# EAGLE design dengenver4.1 (EAGLE 9.6.2)
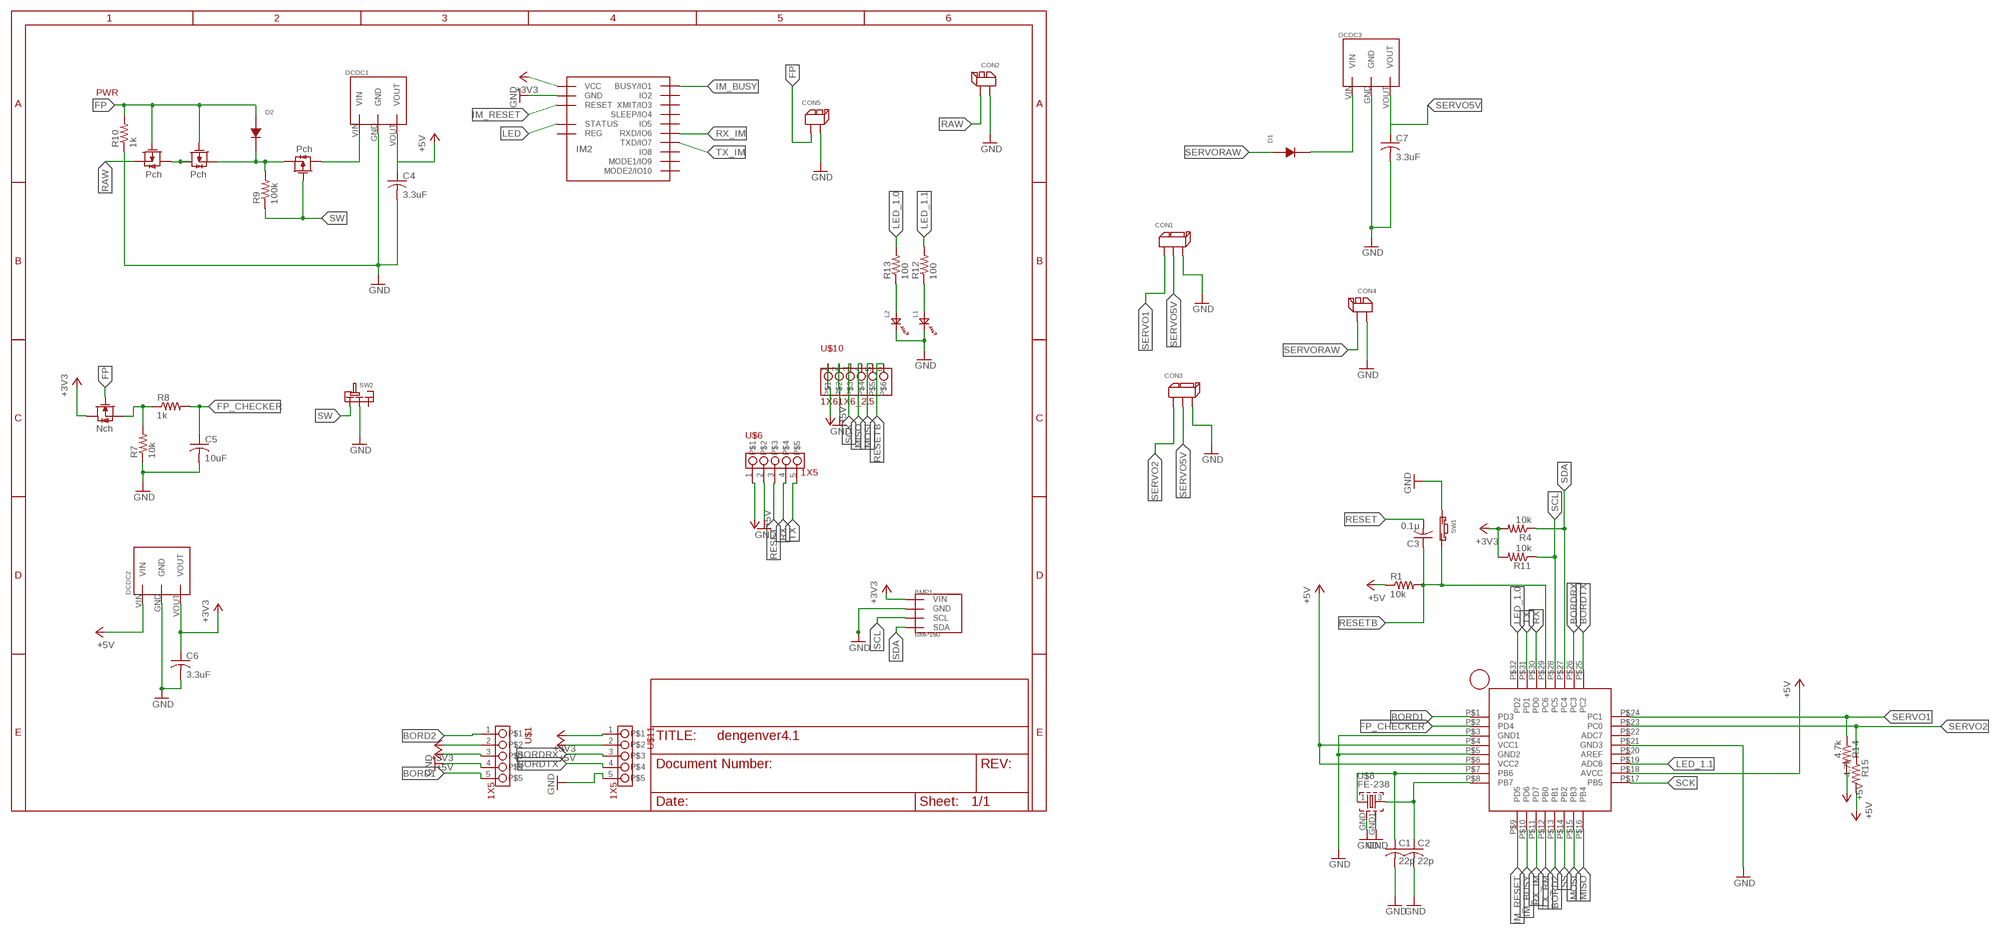
[diagram p0: schematic, sheet 1]

## Parts
BMP1  BMP180  [GY-68]
C1  22p  C-USC1608  [C1608]
C2  22p  C-USC1608  [C1608]
C3  0.1μ  C-USC1608  [C1608]
C4  3.3uF  C-USC1608  [C1608]
C5  10uF  C-USC1608  [C1608]
C6  3.3uF  C-USC1608  [C1608]
C7  3.3uF  C-USC0603  [C0603]
CON1  3PIN  [3PIN]
CON2  2PIN  [2PIN]
CON3  3PIN  [3PIN]
CON4  2PIN  [2PIN]
CON5  2PIN  [2PIN]
D1  1W4148W  [SOD-123]
D2  1W4148W  [SOD-123]
DCDC1  5V1A_M78AR05-1  [5V1A_M78AR05-1]
DCDC2  3.3V1A_M78AR033-1  [3.3V1A_M78AR033-1]
DCDC3  5V1A_M78AR05-1  [5V1A_M78AR05-1]
IM2  IM920_IM920C  [IM920_IM920C]
L1  OSXX1608C1A  [OSXX1608C1A]
L2  OSXX1608C1A  [OSXX1608C1A]
R1  10k  R-US_R0603  [R0603]
R4  10k  R-US_R0603  [R0603]
R7  10k  R-US_R0603  [R0603]
R8  1k  R-US_R0603  [R0603]
R9  100k  R-US_R0603  [R0603]
R10  1k  R-US_R0603  [R0603]
R11  10k  R-US_R0603  [R0603]
R12  100  R-US_R0603  [R0603]
R13  100  R-US_R0603  [R0603]
R14  4.7k  R-US_R0603  [R0603]
R15  4.7k  R-US_R0603  [R0603]
SW1  TVAF06-A020B-R  [TVAF06-A020B-R]
SW2  SRIDE_SWITCH  [SRIDE_SWITCH]
U$1  1X5  [HDRVR5W64P254_1X5_1310X250X865B]
U$2  2SJ681-PCH  [2SJ681]
U$3  2SK4017-NCH  [2SK4017]
U$4  2SJ681-PCH  [2SJ681]
U$5  2SJ681-PCH  [2SJ681]
U$6  1X5  [HDRVR5W64P254_1X5_1310X250X865B]
U$7  ATMEGA328P-AUATMEGA328P-AU  [ATMEGA328P-AU]
U$8  FE-238  [OSCCC300X230X120N]
U$10  1X61X6_2.5  [HDRVR6W64P254_1X6_1564X250X865B]
U$11  1X5  [HDRVR5W64P254_1X5_1310X250X865B]

## Nets
+3V3: BMP1.P1(VIN) C6.1 DCDC2.VOUT IM2.$P17(VCC) R4.2 R11.2 U$1.2 U$3.DRAIN U$11.1
+5V: C4.1 DCDC1.VOUT DCDC2.VIN R1.1 R14.2 R15.2 U$1.3 U$6.1 U$7.P$4(VCC1) U$7.P$6(VCC2) U$7.P$18(AVCC) U$10.1 U$11.2
+5V1: DCDC1.VIN U$5.DRAIN
BORD1: U$1.5 U$7.P$1(PD3)
BORD2: U$1.1 U$7.P$13(PB1)
BORDRX: U$7.P$26(PC3) U$11.3
BORDTX: U$7.P$25(PC2) U$11.4
FP: CON5.P$1 D2.C R10.2 U$2.GATE U$3.GATE U$4.GATE
FP1: D1.C
FP_CHECKER: C5.1 R8.2 U$7.P$2(PD4)
GND: BMP1.P2(GND) C1.2 C2.2 C4.2 C5.2 C6.2 C7.2 CON1.P$3 CON2.P$1 CON3.P$3 CON4.P$1 CON5.P$2 DCDC1.GND DCDC2.GND DCDC3.GND IM2.$P18(GND) L1.CT L2.CT R7.1 R10.1 SW1.P$1 SW2.LR U$1.4 U$6.2 U$7.P$3(GND1) U$7.P$5(GND2) U$7.P$21(GND3) U$8.GND U$8.GND1 U$10.2 U$11.5
IM_BUSY: IM2.$P1(BUSY/IO1) U$7.P$10(PD6)
IM_RESET: IM2.$P19(RESET) U$7.P$9(PD5)
LED: IM2.$P15(STATUS)
LED_1.0: R13.2 U$7.P$32(PD2)
LED_1.1: R12.2 U$7.P$19(ADC6)
MISO: U$7.P$16(PB4) U$10.4
MOSI: U$7.P$15(PB3) U$10.5
N$2: U$2.DRAIN U$4.DRAIN
N$3: D2.A R9.2 U$4.SOURCE U$5.SOURCE
N$9: L2.AN R13.1
N$10: L1.AN R12.1
N$12: C1.1 U$7.P$7(PB6) U$8.1
N$13: C2.1 U$7.P$8(PB7) U$8.3
N$14: R7.2 R8.1 U$3.SOURCE
RAW: CON2.P$2 U$2.SOURCE
RESET: C3.2 U$6.3
RESETB: C3.1 R1.2 SW1.P$2 U$7.P$29(PC6) U$10.6
RX: U$6.4 U$7.P$30(PD0)
RX_IM: IM2.$P6(RXD/IO6) U$7.P$11(PD7)
SCK: U$7.P$17(PB5) U$10.3
SCL: BMP1.P3(SCL) R11.1 U$7.P$28(PC5)
SDA: BMP1.P4(SDA) R4.1 U$7.P$27(PC4)
SERVO1: CON1.P$1 R14.1 U$7.P$24(PC1)
SERVO2: CON3.P$1 R15.1 U$7.P$23(PC0)
SERVO5V: C7.1 CON1.P$2 CON3.P$2 DCDC3.VOUT
SERVORAW: CON4.P$2 D1.A DCDC3.VIN
SS: U$7.P$14(PB2)
SW: R9.1 SW2.L U$5.GATE
TX: U$6.5 U$7.P$31(PD1)
TX_IM: IM2.$P7(TXD/IO7)
TX_RM: U$7.P$12(PB0)
Unconnected: IM2.$P2(IO2) IM2.$P3(XMIT/IO3) IM2.$P4(SLEEP/IO4) IM2.$P5(IO5) IM2.$P8(IO8) IM2.$P9(MODE1/IO9) IM2.$P10(MODE2/IO10) IM2.$P16(REG) SW2.R U$7.P$20(AREF) U$7.P$22(ADC7)

## Notes on the sheet
- PWR

## Library data of the parts
BMP1 = BMP180:BMP180
C1-C7 = rcl:C-US: CAPACITOR, American symbol; SPICEPREFIX: C
CON1 CON3 = XR Connector:3PIN
CON2 CON4 CON5 = XR Connector:2PIN
D1 D2 = ChipDiodes:1W4148W
DCDC1 DCDC3 = DC-DC:5V1A_M78AR05-1
DCDC2 = DC-DC:3.3V1A_M78AR033-1
IM2 = CANSAT12th:IM920_IM920C
L1 L2 = Chip LED:OSXX1608C1A
R1 R4 R7-R15 = rcl:R-US_: RESISTOR, American symbol; SPICEPREFIX: R
SW1 = Tact switch:TVAF06-A020B-R
SW2 = Sride Switch:SRIDE_SWITCH
U$1 U$6 U$11 = pin_socket:1X5
U$2 U$4 U$5 = mosfet:2SJ681-PCH
U$3 = mosfet:2SK4017-NCH
U$7 = ATMEGA328P-AU:ATMEGA328P-AU
U$8 = FA-238:FE-238
U$10 = pin_socket:1X6

## Board
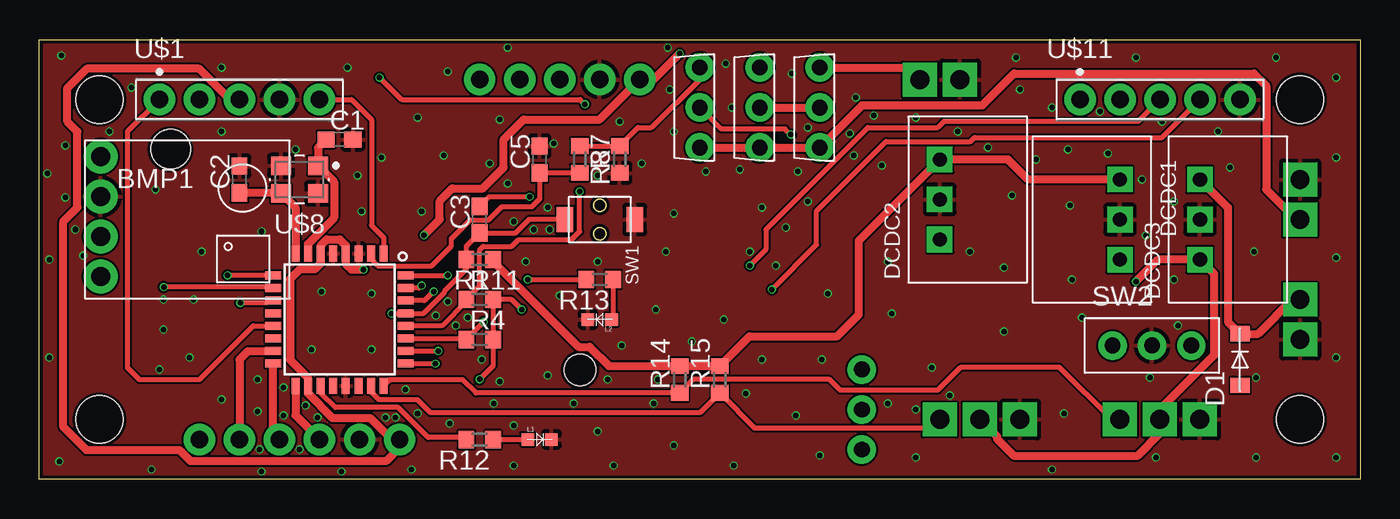
[diagram p1: board, top side]
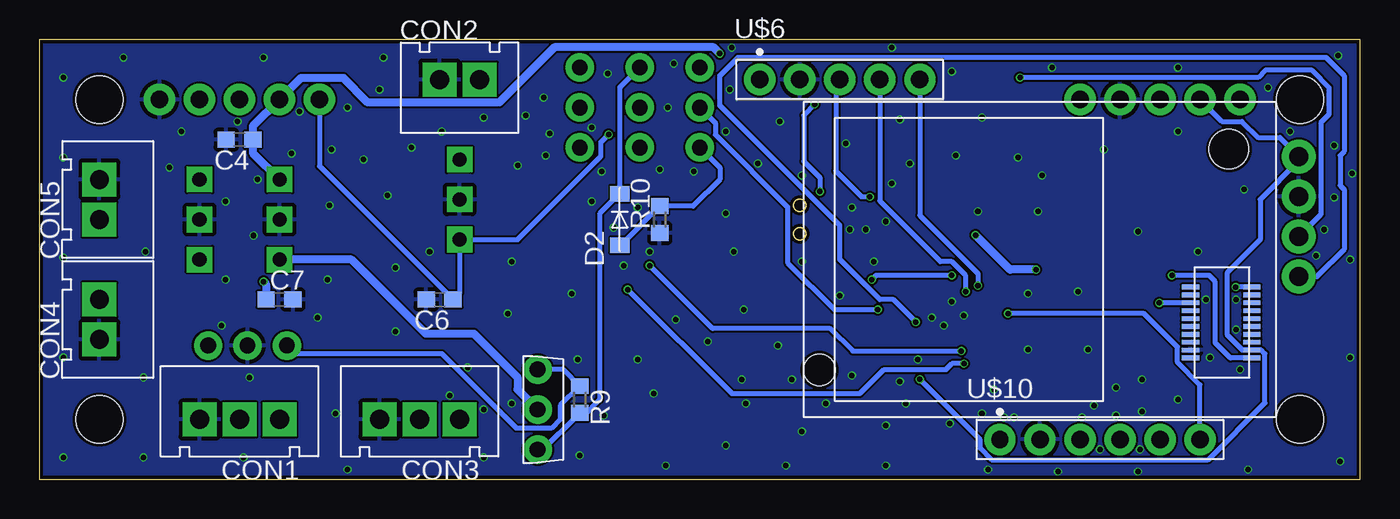
[diagram p2: board, bottom side, seen from below]

Size 83.82 x 27.94 mm. Coordinates in mm from the lower left corner, seen from the top.
Outline: 0,0 0,27.94 83.82,27.94 83.82,0 0,0
Copper layers (1*16): Top 0.035mm / dielectric 1.6mm / Bottom 0.035mm
Design rules "jlcpcb-2layers": minimum track width 5mil, minimum drill 0.3mm, track to track 5mil, track to pad 5mil, pad to pad 5mil, via to via 5mil, smd to smd 5mil, copper to edge 0.2mm, drill to drill 6mil, minimum pad ring 10mil, minimum via ring 3mil, stop-mask expansion 4mil, vias tented up to drill 0mil, thermal gap 10mil
Holes 3 mm at 3.81,24.13 3.81,3.81 80.01,3.81 80.01,24.13

### Footprints (pad centres in the part's own frame; a part is rotated, then mirrored left to right if it is on the bottom)
GY-68 = drill 1.2: P1 -5,4; P2 -5,1.46; P3 -5,-1.08; P4 -5,-3.62
C1608 = smd 1.1 x 1: 1 -0.85,0; 2 0.85,0
C0603 = smd 1.1 x 1: 1 -0.85,0; 2 0.85,0
3PIN = drill 1.2 square: P$1 2.54,-2.54; P$2 5.08,-2.54; P$3 7.62,-2.54
2PIN = drill 1.2 square: P$1 -1.27,0; P$2 1.27,0
SOD-123 = smd 0.97 x 1.22: A 1.64,0; C -1.64,0
5V1A_M78AR05-1 = drill 0.9 pad 1.27 square: GND 0,0; VIN 2.54,0; VOUT -2.54,0
3.3V1A_M78AR033-1 = drill 0.9 pad 1.27 square: GND 0,0; VIN 2.54,0; VOUT -2.54,0
IM920_IM920C = smd 0.3 x 1.1: $P1 -1.75,-13.45; $P2 -1.75,-9.55; $P3 -2.25,-13.45; $P4 -2.25,-9.55; $P5 -2.75,-13.45; $P6 -2.75,-9.55; $P7 -3.25,-13.45; $P8 -3.25,-9.55; $P9 -3.75,-13.45; $P10 -3.75,-9.55; $P11 -4.25,-13.45; $P12 -4.25,-9.55; $P13 -4.75,-13.45; $P14 -4.75,-9.55; $P15 -5.25,-13.45; $P16 -5.25,-9.55; $P17 -5.75,-13.45; $P18 -5.75,-9.55; $P19 -6.25,-13.45; $P20 -6.25,-9.55 | hole 2.5: 7,-12 | hole 2: -7,14
OSXX1608C1A = smd 0.8 x 0.8: AN -0.75,0; CT 0.75,0
R0603 = smd 1 x 1.1: 1 -0.85,0; 2 0.85,0
TVAF06-A020B-R = smd 1.6 x 1.05: P$1 0,2.225; P$2 0,-2.225
SRIDE_SWITCH = drill 1: L -2.5,0; LR 0,0; R 2.5,0
HDRVR5W64P254_1X5_1310X250X865B = drill 1.105 pad 1.705: 1 0,0; 2 2.54,0; 3 5.08,0; 4 7.62,0; 5 10.16,0
2SJ681 = drill 1: DRAIN 0,0; GATE 2.54,0; SOURCE -2.54,0
2SK4017 = drill 1: DRAIN 0,0; GATE 2.54,0; SOURCE -2.54,0
ATMEGA328P-AU = smd 1.016 x 0.508: P$1 -4.2,2.8; P$2 -4.2,2; P$3 -4.2,1.2; P$4 -4.2,0.4; P$5 -4.2,-0.4; P$6 -4.2,-1.2; P$7 -4.2,-2; P$8 -4.2,-2.8; P$17 4.2,-2.8; P$18 4.2,-2; P$19 4.2,-1.2; P$20 4.2,-0.4; P$21 4.2,0.4; P$22 4.2,1.2; P$23 4.2,2; P$24 4.2,2.8 | smd 0.508 x 1.016: P$9 -2.8,-4.2; P$10 -2,-4.2; P$11 -1.2,-4.2; P$12 -0.4,-4.2; P$13 0.4,-4.2; P$14 1.2,-4.2; P$15 2,-4.2; P$16 2.8,-4.2; P$25 2.8,4.2; P$26 2,4.2; P$27 1.2,4.2; P$28 0.4,4.2; P$29 -0.4,4.2; P$30 -1.2,4.2; P$31 -2,4.2; P$32 -2.8,4.2
OSCCC300X230X120N = smd 1.262 x 1.162: 1 -1.175,-0.875; 3 1.175,0.875; GND 1.175,-0.875; GND1 -1.175,0.875
HDRVR6W64P254_1X6_1564X250X865B = drill 1.105 pad 1.705: 1 0,0; 2 2.54,0; 3 5.08,0; 4 7.62,0; 5 10.16,0; 6 12.7,0

### Placement (x,y rotation side)
BMP1  8.89,16.51 0 top
C1  19.05,21.59 0 top
C2  12.7,19.05 90 top
C3  27.94,16.51 90 top
C4  71.12,21.59 180 bottom
C5  31.75,20.32 90 top
C6  58.42,11.43 180 bottom
C7  68.58,11.43 0 bottom
CON1  66.04,1.27 180 bottom
CON2  57.15,25.4 0 bottom
CON3  54.61,1.27 180 bottom
CON4  80.01,10.16 90 bottom
CON5  80.01,17.78 90 bottom
D1  76.2,7.62 90 top
D2  46.99,16.51 90 bottom
DCDC1  68.58,16.51 270 top
DCDC2  57.15,17.78 90 top
DCDC3  73.66,16.51 90 top
IM2  20.32,13.97 90 bottom
L1  31.75,2.54 0 top
L2  35.56,10.16 180 top
R1  27.94,13.97 180 top
R4  27.94,8.89 0 top
R7  36.83,20.32 90 top
R8  34.29,20.32 270 top
R9  49.53,5.08 270 bottom
R10  44.45,16.51 90 bottom
R11  27.94,11.43 0 top
R12  27.94,2.54 180 top
R13  35.56,12.7 180 top
R14  40.64,6.35 90 top
R15  43.18,6.35 90 top
SW1  35.56,16.51 270 top
SW2  70.61,8.51 0 top
U$1  7.62,24.13 0 top
U$2  49.53,23.62 270 top
U$3  41.91,23.62 270 top
U$4  45.72,23.62 270 top
U$5  52.2,4.45 90 bottom
U$6  38.1,25.4 0 bottom
U$7  19.05,10.16 270 top
U$8  16.51,19.05 180 top
U$10  22.86,2.54 0 bottom
U$11  66.04,24.13 0 top

### Tracks (layer width: path | path; a pad name or v marks a point on that pad's centre or on a via)
+3V3  (via drill 0.35)
  Top 0.305: v27.94,6.36 28.79,7.21 R4.2 R11.2 29.97,11.43 v30.61,10.79 | v47.69,21.91 47.33,22.26 43.27,22.26 U$3.DRAIN
  Bottom 0.305: v27.94,6.36 24.13,2.56 24.13,2.01 23.39,1.27 9.63,1.27 6.04,4.86 6.04,7.99 6.28,8.22 IM2.$P17 7.48,8.22 8.43,9.17 8.43,13.16 6.35,15.24 6.35,17.78 3.89,20.24 BMP1.P1 5.09,21.71 6.47,21.71 7.49,22.73 8.76,22.73 U$1.2 | U$11.1 66.04,19.9 C6.1 57.15,11.85 DCDC2.VOUT 53.47,15.24 48.2,20.51 48.2,21.4 v47.69,21.91 | U$3.DRAIN 40.92,22.63 40.92,21.9 36.34,17.31 36.34,13.76 33.38,10.79 v30.61,10.79
+5V  (via drill 0.35)
  Top 0.508: DCDC1.VOUT 62.74,19.05 61.47,20.32 DCDC2.VIN 51.99,15.16 51.99,10.46 50.62,9.1 45.08,9.1 R15.2 R14.2 36.15,7.2 34.92,8.42 34.21,8.42 28.79,13.84 R1.1 | v24.41,15.52 25.4,16.51 25.4,17.67 26.21,18.48 28.13,18.48 29.46,19.81 29.46,21.59 30.73,22.86 35.56,22.86 U$6.1 38.99,25.4 v40.64,27.05 | U$1.3 12.11,24.13 10.15,26.08 3,26.08 1.78,24.86 1.78,22.73 2.41,22.1 2.41,17.27 1.52,16.38 1.52,3.33 3,1.86 8.9,1.86 9.59,1.16 21.99,1.16 22.86,2.03 U$10.1 22.35,2.54 20.98,3.92 18.59,3.92 17.05,5.46 U$7.P$18 17.05,6.47 15.91,7.61 15.91,12.73 16.52,13.34 17.47,13.34 17.85,13.72 U$7.P$6 17.85,14.86 18.24,15.25 19.06,15.25 19.45,14.86 U$7.P$4 19.45,13.7 19.81,13.33 v20.57,13.33
  Bottom 0.508: v20.57,13.33 22.22,13.33 v24.41,15.52 | v40.64,27.05 41.03,27.44 51.14,27.44 54.64,23.94 62.98,23.94 64.54,25.51 67.2,25.51 U$11.2 70.27,22.44 C4.1 70.27,20.74 DCDC1.VOUT
+5V1
  Bottom 0.508: DCDC1.VIN 64.01,13.97 59.31,9.27 56.26,9.27 53.48,6.49 53.48,5.73 U$5.DRAIN
BORD1
  Top 0.305: U$1.5 19.81,24.13 21.08,22.86 21.08,16.13 21.85,15.36 U$7.P$1
BORD2
  Top 0.305: U$1.1 5.59,22.1 5.59,7.11 6.35,6.35 10.16,6.35 13.57,9.76 U$7.P$13
BORDRX  (via drill 0.35)
  Top 0.305: U$11.3 69.72,22.73 57.4,22.73 57.02,22.35 52.58,22.35 46.1,15.88 46.1,14.61 v45.09,13.59 | U$7.P$26 v25.3,8.16
  Bottom 0.305: v25.3,8.16 32.2,8.16 33.63,9.59 41.09,9.59 v45.09,13.59
BORDTX  (via drill 0.35)
  Top 0.305: U$7.P$25 v25.14,7.36 | v46.48,12.06 49.33,14.91 49.33,17.05 53.74,21.46 59.1,21.46 59.35,21.72 71.25,21.72 U$11.4
  Bottom 0.305: v25.14,7.36 25.9,7.36 26.28,6.98 30.22,6.98 31.74,5.46 39.87,5.46 v46.48,12.06
FP
  Top 0.508: U$3.GATE U$4.GATE U$2.GATE 52.2,23.75 59.82,23.75 61.85,25.78 77.09,25.78 77.85,25.02 77.85,18.41 79.76,16.51 CON5.P$1
  Bottom 0.305: U$3.GATE 40.64,19.81 40.64,19.05 42.33,17.36 R10.2 46.94,14.87 D2.C
FP_CHECKER
  Top 0.305: R8.2 C5.1 31.75,17.82 31.24,17.31 29.34,17.31 28.52,16.49 27.32,16.49 26.14,15.31 26.14,14.84 24.88,13.57 21.48,13.57 21.05,14 U$7.P$2
GND  (via drill 0.35)
  other vias: 44.45,19.68 48.13,19.56 45.85,17.27 42.29,19.56 45.09,14.48 51.44,21.97 63.25,20.32 62.23,24.77 55.63,22.99 65.28,20.95 58.29,22.1 64.26,23.62 51.69,20.57 60.2,21.08 48.77,17.65 47.37,16 46.74,13.59 67.31,23.37 61.21,13.46 53.47,19.94 59.05,14.48 50.04,11.81 53.85,13.84 54.1,10.54 61.72,18.03 65.53,12.7 61.21,9.4 49.66,7.62 45.85,7.62 44.83,5.46 48.01,4.06 53.85,4.83 55.63,4.45 57.79,5.33 55.63,1.4 64.26,0.64 70.87,1.4 77.22,6.48 72.26,9.78 77.09,14.48 82.3,14.1 82.3,7.75 82.3,20.45 75.56,19.81 78.49,26.8 61.98,26.8 69.6,26.8 52.96,23.11 51.82,24.26 43.94,23.62 47.75,25.78 43.56,26.42 48.77,22.35 39.88,27.43 29.72,27.43 25.91,25.91 19.56,26.16 11.56,26.16 1.4,26.92 0.51,19.43 0.64,13.97 0.64,7.75 1.27,1.14 7.11,0.64 23.62,0.64 14.1,0.51 19.18,0.51 17.27,8.26 17.91,11.94 21.08,11.81 21.08,8.26 11.56,5.08 13.84,6.35 13.84,4.32 15.49,5.84 15.49,4.06 16.89,4.7 17.65,3.94 13.97,1.91 16.51,1.91 7.87,11.43 7.87,9.53 7.62,6.98 9.53,7.75 9.78,11.43 14.1,15.75 10.29,14.48 11.56,22.1 20.19,19.3 24,22.99 24.26,17.02 20.45,17.02 7.37,18.41 16.26,20.95 39.12,10.79 39.75,14.48 35.43,19.3 40.26,16.89 40.26,22.1 43.43,10.16 41.4,8.76 36.96,8.51 36.07,6.35 39.24,6.35 38.99,4.83 33.91,4.83 28.83,4.83 24,4.19 23.24,5.71 26.04,3.56 30.1,3.43 30.1,0.89 36.45,0.89 44.07,0.89 40.26,2.16 35.43,3.05 49.53,1.52 21.97,3.94 22.61,3.94 29.21,6.22 32.26,6.6 26.42,9.78 25.15,10.41 28.07,7.62 25.91,11.3 27.18,10.29 33.02,11.68 35.43,13.84 82.3,1.4 77.22,1.4 82.3,25.53 70.23,15.49 67.82,20.7 66.17,10.29 70.48,6.48 38.23,20.07 40.01,24.77 29.21,22.86 29.72,18.8 32.64,21.34 32.38,15.88 31.37,15.88 32.26,17.27 30.86,13.84 30.1,16.38 28.57,20.07 25.65,20.57 21.72,20.45 2.79,14.22 2.29,15.88 1.65,17.91 1.65,21.21 72.01,17.65 72.01,12.7 56.64,7.11 71.25,22.73 74.8,22.1 5.84,24.89 4.45,22.1 65.41,17.4 69.98,19.05 65.02,4.19 36.83,22.73
  pour Top: 97.79,1.27 72.39,-24.13 -46.99,-24.13 -77.47,6.35 -77.47,62.23 -46.99,92.71 45.72,92.71 72.39,92.71 91.44,73.66 97.79,67.31
  pour Bottom: -46.99,-24.13 -77.47,6.35 -77.47,63.5 -48.26,92.71 71.12,92.71 97.79,66.04 97.79,2.54 69.85,-25.4 -46.99,-25.4
IM_BUSY  (via drill 0.35)
  Top 0.305: U$7.P$10 14.56,12.16 14.5,12.22 v7.9,12.22
  Bottom 0.305: IM2.$P1 v7.9,12.22
IM_RESET  (via drill 0.35)
  Top 0.305: U$7.P$9 v11.94,12.96
  Bottom 0.305: IM2.$P19 8.23,7.72 9.19,8.68 9.19,12.57 9.58,12.96 v11.94,12.96
LED_1.0  (via drill 0.35)
  Top 0.305: U$7.P$32 v25.91,12.96 | v30.99,12.7 R13.2
  Bottom 0.305: v25.91,12.96 30.73,12.96 v30.99,12.7
LED_1.1
  Top 0.305: U$7.P$19 17.85,5.83 17.86,5.82 17.86,5.5 18.79,4.57 22.77,4.57 24.68,2.67 26.96,2.67 R12.2
MISO
  Top 0.508: U$7.P$16 14.85,2.93 U$10.4
MOSI
  Top 0.508: U$7.P$15 13.24,8.16 12.7,7.62 U$10.5
N$2
  Top 0.508: U$4.DRAIN U$2.DRAIN
N$3
  Bottom 0.305: R9.2 49.74,4.02 | 49.74,4.02 51.86,1.91 U$5.SOURCE | U$4.SOURCE 46.99,24.89 D2.A 48.26,16.88 48.26,5.08 49.32,4.02 49.74,4.02
N$9
  Top 0.305: R13.1 36.41,10.26 L2.AN
N$10
  Top 0.305: R12.1 L1.AN
N$12
  Top 0.508: U$7.P$7 17.05,14.96 18.7,16.61 18.7,18.91 18.47,19.14 U$8.1 17.68,21.07 C1.1
N$13
  Top 0.508: C2.1 12.72,18.18 U$8.3 16.25,17.26 U$7.P$8
N$14
  Top 0.305: R8.1 R7.2 38.01,22.35 38.86,22.35 41.91,25.4 U$3.SOURCE
RAW
  Top 0.508: U$2.SOURCE 55.12,26.16 CON2.P$2
RESET  (via drill 0.35)
  Top 0.305: v31.11,17.95 28.53,17.95 C3.2
  Bottom 0.305: v31.11,17.95 31.62,17.95 33.27,19.6 33.27,25.15 U$6.3
RESETB  (via drill 0.35)
  Top 0.305: v22.35,10.54 23.23,10.54 U$7.P$29 24.39,10.56 25.69,11.86 25.69,11.94 27.09,13.33 R1.2 27.09,14.81 C3.1 30.23,15.66 31.08,16.51 SW1.P$2
  Bottom 0.305: U$10.6 10.16,6.02 11.6,7.45 11.6,8.42 13.72,10.54 v22.35,10.54
RX  (via drill 0.35)
  Top 0.305: v25.02,11.94 24.44,11.36 U$7.P$30
  Bottom 0.305: v25.02,11.94 25.02,12.96 25.91,13.84 26.64,13.84 30.48,17.69 U$6.4
RX_IM  (via drill 0.35)
  Top 0.305: U$7.P$11 14.54,11.36 14.39,11.22 v12.74,11.22
  Bottom 0.305: IM2.$P6 v12.74,11.22
SCK
  Top 0.508: U$7.P$17 16.25,4.07 U$10.3
SCL  (via drill 0.35)
  Top 0.305: U$7.P$28 25.55,9.76 27.09,11.3 R11.1 27.94,12.28 27.94,14.56 28.17,14.8 29.98,14.8 30.42,15.24 33.79,15.24 34.29,15.74 v34.29,18.29 | v34.62,23.82 34.32,24.13 23,24.13 v21.59,25.53
  Bottom 0.305: v34.29,18.29 34.29,19.18 35.31,20.2 35.31,23.13 v34.62,23.82 | BMP1.P3 2.49,16.83 2.49,22.65 1.96,23.19 1.96,24.9 3.04,25.98 6.02,25.98 6.47,25.53 v21.59,25.53
SDA  (via drill 0.35)
  Top 0.305: U$7.P$27 27.02,8.96 R4.1 v28.19,9.99
  Bottom 0.305: v28.19,9.99 29.63,11.43 30.48,11.43 33.02,13.97 33.02,16.13 40.64,23.75 40.64,25.65 39.5,26.8 2.16,26.8 1.02,25.65 1.02,20.83 1.27,20.57 1.27,18.67 1.02,18.41 1.02,14.62 2.75,12.89 BMP1.P4
SERVO1
  Top 0.305: U$7.P$24 22.23,6.34 26.87,6.34 27.71,5.5 R14.1 41.49,6.35 50.15,6.35 50.82,5.68 57.02,5.68 58.49,7.15 64.71,7.15 68.05,3.81 CON1.P$1
SERVO2
  Top 0.305: U$7.P$23 21.05,5.58 21.56,5.07 24,5.07 24.82,4.24 41.92,4.24 R15.1 45.41,3.27 56.61,3.27 CON3.P$1
SERVO5V  (via drill 0.35)
  Top 0.508: v69.6,12.57 70.99,13.97 DCDC3.VOUT 74.55,13.08 74.55,7.87 71.12,4.45 CON1.P$2 71.12,2.92 69.71,1.51 61.83,1.51 60.77,2.57 60.77,2.73 CON3.P$2
  Bottom 0.508: v69.6,12.57 69.43,12.41 C7.1
SERVORAW
  Top 0.508: DCDC3.VIN 75.44,17.27 75.44,10.02 D1.A 77.34,9.26 79.51,11.43 CON4.P$2
SW
  Bottom 0.305: SW2.L 67.6,8 58.29,8 53.55,3.27 51.33,3.27 50.76,3.83 50.76,4.7 R9.1 50.59,6.98 U$5.GATE
TX  (via drill 0.35)
  Top 0.305: v24.26,12.32 24.1,12.16 U$7.P$31
  Bottom 0.305: v24.26,12.32 24.26,13.08 27.94,16.76 U$6.5